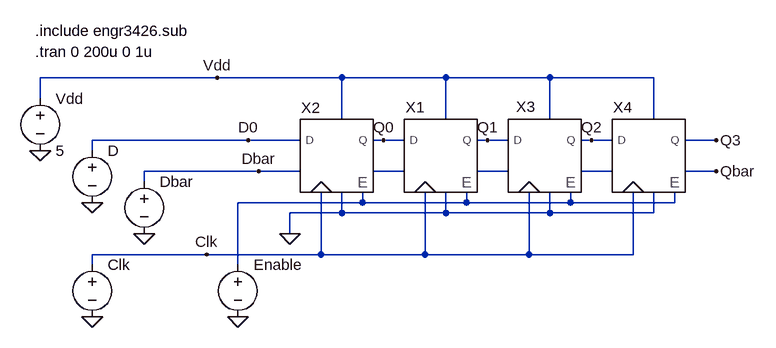
[diagram p0: schematic shiftreg4.asc]
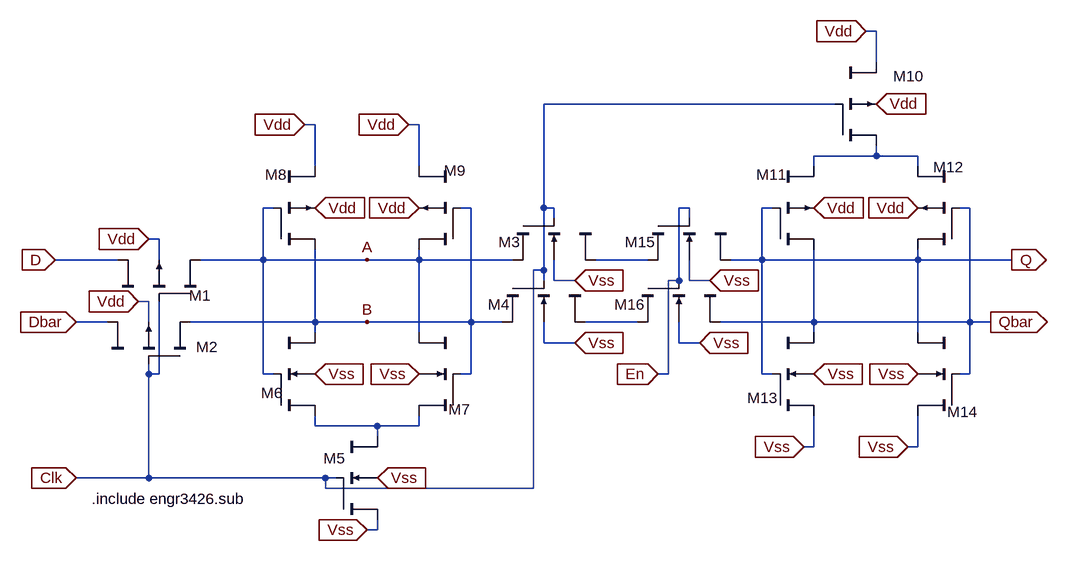
[diagram p1: sub-circuit dflipflop.asc]
shiftreg4.asc, the LTspice schematic file:
Version 4
SHEET 1 928 680
WIRE 80 64 -192 64
WIRE 272 64 80 64
WIRE 432 64 272 64
WIRE 592 64 432 64
WIRE 752 64 592 64
WIRE -192 96 -192 64
WIRE 272 128 272 64
WIRE 432 128 432 64
WIRE 592 128 592 64
WIRE 752 128 752 64
WIRE 128 160 -112 160
WIRE 208 160 128 160
WIRE 336 160 320 160
WIRE 368 160 336 160
WIRE 496 160 480 160
WIRE 528 160 496 160
WIRE 656 160 640 160
WIRE 688 160 656 160
WIRE 848 160 800 160
WIRE -112 176 -112 160
WIRE 144 208 -32 208
WIRE 208 208 144 208
WIRE 368 208 320 208
WIRE 528 208 480 208
WIRE 688 208 640 208
WIRE 848 208 800 208
WIRE -32 224 -32 208
WIRE 304 256 304 240
WIRE 304 256 112 256
WIRE 464 256 464 240
WIRE 464 256 304 256
WIRE 624 256 624 240
WIRE 624 256 464 256
WIRE 784 256 784 240
WIRE 784 256 624 256
WIRE 272 272 272 240
WIRE 272 272 192 272
WIRE 432 272 432 240
WIRE 432 272 272 272
WIRE 592 272 592 240
WIRE 592 272 432 272
WIRE 752 272 752 240
WIRE 752 272 592 272
WIRE 192 304 192 272
WIRE 64 336 -112 336
WIRE 240 336 240 240
WIRE 240 336 64 336
WIRE 400 336 400 240
WIRE 400 336 240 336
WIRE 560 336 560 240
WIRE 560 336 400 336
WIRE 720 336 720 240
WIRE 720 336 560 336
WIRE -112 352 -112 336
WIRE 112 352 112 256
FLAG -192 176 0
FLAG -112 432 0
FLAG -32 304 0
FLAG -112 256 0
FLAG 128 160 D0
FLAG 64 336 Clk
FLAG 848 208 Qbar
FLAG 144 208 Dbar
FLAG 80 64 Vdd
FLAG 192 304 0
FLAG 336 160 Q0
FLAG 496 160 Q1
FLAG 656 160 Q2
FLAG 848 160 Q3
FLAG 112 432 0
SYMBOL voltage -192 80 R0
WINDOW 123 0 0 Left 2
WINDOW 39 0 0 Left 2
SYMATTR InstName Vdd
SYMATTR Value 5
SYMBOL voltage -112 336 R0
WINDOW 3 24 96 Invisible 2
WINDOW 123 0 0 Left 2
WINDOW 39 0 0 Left 2
SYMATTR Value PULSE(0 5 2u 1n 1n 7u 14u 100)
SYMATTR InstName Clk
SYMBOL voltage -32 208 R0
WINDOW 3 24 96 Invisible 2
WINDOW 123 0 0 Left 2
WINDOW 39 0 0 Left 2
SYMATTR Value PULSE(5 0 10u 1n 1n 10u 80u 2)
SYMATTR InstName Dbar
SYMBOL voltage -112 160 R0
WINDOW 3 24 96 Invisible 2
WINDOW 123 0 0 Left 2
WINDOW 39 0 0 Left 2
SYMATTR Value PULSE(0 5 10u 1n 1n 10u 80u 2)
SYMATTR InstName D
SYMBOL dflipflop 272 192 R0
WINDOW 0 -48 -66 Bottom 2
SYMATTR InstName X2
SYMBOL dflipflop 432 192 R0
WINDOW 0 -47 -67 Bottom 2
SYMATTR InstName X1
SYMBOL dflipflop 592 192 R0
WINDOW 0 -37 -68 Bottom 2
SYMATTR InstName X3
SYMBOL dflipflop 752 192 R0
WINDOW 0 -48 -67 Bottom 2
SYMATTR InstName X4
SYMBOL voltage 112 336 R0
WINDOW 3 24 96 Invisible 2
WINDOW 123 0 0 Left 2
WINDOW 39 0 0 Left 2
SYMATTR Value PULSE(5 0 0 1n 1n 100u 200u 1)
SYMATTR InstName Enable
TEXT -200 24 Left 2 !.tran 0 200u 0 1u
TEXT -200 -8 Left 2 !.include engr3426.sub

dflipflop.asc, the sub-circuit schematic file:
Version 4
SHEET 1 1276 680
WIRE 976 -432 960 -432
WIRE 976 -384 976 -432
WIRE 912 -320 464 -320
WIRE 112 -288 96 -288
WIRE 272 -288 256 -288
WIRE 976 -240 976 -256
WIRE 976 -240 880 -240
WIRE 1040 -240 976 -240
WIRE 112 -224 112 -288
WIRE 272 -224 272 -288
WIRE 880 -224 880 -240
WIRE 1040 -224 1040 -240
WIRE 48 -160 32 -160
WIRE 352 -160 336 -160
WIRE 464 -160 464 -320
WIRE 480 -160 464 -160
WIRE 688 -160 672 -160
WIRE 816 -160 800 -160
WIRE 1120 -160 1104 -160
WIRE 480 -144 480 -160
WIRE 688 -144 688 -160
WIRE -128 -112 -144 -112
WIRE -192 -80 -288 -80
WIRE -128 -80 -128 -112
WIRE 32 -80 32 -160
WIRE 32 -80 -64 -80
WIRE 192 -80 32 -80
WIRE 272 -80 272 -96
WIRE 272 -80 192 -80
WIRE 416 -80 272 -80
WIRE 624 -80 544 -80
WIRE 800 -80 800 -160
WIRE 800 -80 752 -80
WIRE 1040 -80 1040 -96
WIRE 1040 -80 800 -80
WIRE 1184 -80 1040 -80
WIRE 464 -64 464 -160
WIRE 464 -64 448 -64
WIRE 464 -48 464 -64
WIRE 480 -48 480 -80
WIRE 512 -48 480 -48
WIRE 672 -48 672 -160
WIRE 672 -48 656 -48
WIRE 688 -48 688 -80
WIRE 720 -48 688 -48
WIRE -144 -16 -160 -16
WIRE -208 16 -256 16
WIRE -144 16 -144 -16
WIRE 112 16 112 -96
WIRE 112 16 -80 16
WIRE 192 16 112 16
WIRE 352 16 352 -160
WIRE 352 16 192 16
WIRE 400 16 352 16
WIRE 608 16 528 16
WIRE 880 16 880 -96
WIRE 880 16 736 16
WIRE 1120 16 1120 -160
WIRE 1120 16 880 16
WIRE 1152 16 1120 16
WIRE 112 32 112 16
WIRE 272 32 272 -80
WIRE 880 32 880 16
WIRE 1040 32 1040 -80
WIRE 464 48 464 16
WIRE 512 48 464 48
WIRE 672 48 672 16
WIRE 704 48 672 48
WIRE -144 96 -144 80
WIRE -128 96 -128 -16
WIRE -128 96 -144 96
WIRE 32 96 32 -80
WIRE 48 96 32 96
WIRE 352 96 352 16
WIRE 352 96 336 96
WIRE 656 96 656 -48
WIRE 656 96 640 96
WIRE 800 96 800 -80
WIRE 816 96 800 96
WIRE 1120 96 1120 16
WIRE 1120 96 1104 96
WIRE 112 176 112 160
WIRE 208 176 112 176
WIRE 272 176 272 160
WIRE 272 176 208 176
WIRE 208 192 208 176
WIRE 880 208 880 160
WIRE 880 208 864 208
WIRE 1040 208 1040 160
WIRE 1040 208 1024 208
WIRE -144 256 -144 96
WIRE -144 256 -256 256
WIRE 128 256 -144 256
WIRE 144 256 128 256
WIRE 128 272 128 256
WIRE 448 272 448 -64
WIRE 448 272 128 272
WIRE 208 336 208 320
WIRE 208 336 192 336
FLAG 256 -288 Vdd
IOPIN 256 -288 In
FLAG 96 -288 Vdd
IOPIN 96 -288 In
FLAG 192 336 Vss
IOPIN 192 336 In
FLAG 272 96 Vss
IOPIN 272 96 In
FLAG 112 96 Vss
IOPIN 112 96 In
FLAG 272 -160 Vdd
IOPIN 272 -160 In
FLAG 112 -160 Vdd
IOPIN 112 -160 In
FLAG 208 256 Vss
IOPIN 208 256 In
FLAG -144 -112 Vdd
IOPIN -144 -112 In
FLAG -160 -16 Vdd
IOPIN -160 -16 In
FLAG 512 -48 Vss
IOPIN 512 -48 In
FLAG 512 48 Vss
IOPIN 512 48 In
FLAG 1040 96 Vss
IOPIN 1040 96 In
FLAG 880 96 Vss
IOPIN 880 96 In
FLAG 1040 -160 Vdd
IOPIN 1040 -160 In
FLAG 880 -160 Vdd
IOPIN 880 -160 In
FLAG 976 -320 Vdd
IOPIN 976 -320 In
FLAG 960 -432 Vdd
IOPIN 960 -432 In
FLAG -288 -80 D
IOPIN -288 -80 In
FLAG -256 16 Dbar
IOPIN -256 16 In
FLAG 1184 -80 Q
IOPIN 1184 -80 Out
FLAG 1152 16 Qbar
IOPIN 1152 16 Out
FLAG -256 256 Clk
IOPIN -256 256 In
FLAG 864 208 Vss
IOPIN 864 208 In
FLAG 1024 208 Vss
IOPIN 1024 208 In
FLAG 192 -80 A
FLAG 192 16 B
FLAG 720 -48 Vss
IOPIN 720 -48 In
FLAG 704 48 Vss
IOPIN 704 48 In
FLAG 640 96 En
IOPIN 640 96 In
SYMBOL cktsym\\pmos4 -144 16 R270
WINDOW 0 -38 73 VRight 2
WINDOW 3 16 16 Invisible 2
SYMATTR InstName M2
SYMATTR Value2 l=.6u w=1.2u
SYMBOL cktsym\\pmos4 -128 -80 R270
WINDOW 0 -55 46 VRight 2
WINDOW 3 16 16 Invisible 2
SYMATTR InstName M1
SYMATTR Value2 l=.6u w=1.2u
SYMBOL cktsym\\nmos4 464 16 R90
WINDOW 0 -27 52 VRight 2
WINDOW 3 16 16 Invisible 2
SYMATTR InstName M4
SYMATTR Value2 l=2.4u w=1.2u
SYMBOL cktsym\\nmos4 208 256 R0
WINDOW 0 -83 -30 Left 2
WINDOW 3 16 16 Invisible 2
SYMATTR InstName M5
SYMATTR Value2 l=.6u w=1.2u
SYMBOL cktsym\\nmos4 112 96 R0
WINDOW 0 -83 29 Left 2
WINDOW 3 16 16 Invisible 2
SYMATTR InstName M6
SYMATTR Value2 l=.6u w=1.2u
SYMBOL cktsym\\nmos4 272 96 M0
WINDOW 0 -79 54 Left 2
WINDOW 3 16 16 Invisible 2
SYMATTR InstName M7
SYMATTR Value2 l=.6u w=1.2u
SYMBOL cktsym\\pmos4 112 -160 R0
WINDOW 0 -77 -51 Left 2
WINDOW 3 16 16 Invisible 2
SYMATTR InstName M8
SYMATTR Value2 l=.6u w=1.2u
SYMBOL cktsym\\pmos4 272 -160 M0
WINDOW 0 -72 -57 Left 2
WINDOW 3 16 16 Invisible 2
SYMATTR InstName M9
SYMATTR Value2 l=.6u w=1.2u
SYMBOL cktsym\\pmos4 976 -320 R0
WINDOW 0 26 -43 Left 2
WINDOW 3 16 16 Invisible 2
SYMATTR InstName M10
SYMATTR Value2 l=.6u w=1.2u
SYMBOL cktsym\\nmos4 880 96 R0
WINDOW 0 -103 37 Left 2
WINDOW 3 16 16 Invisible 2
SYMATTR InstName M13
SYMATTR Value2 l=.6u w=1.2u
SYMBOL cktsym\\nmos4 1040 96 M0
WINDOW 0 -92 58 Left 2
WINDOW 3 16 16 Invisible 2
SYMATTR InstName M14
SYMATTR Value2 l=.6u w=1.2u
SYMBOL cktsym\\pmos4 880 -160 R0
WINDOW 0 -89 -51 Left 2
WINDOW 3 16 16 Invisible 2
SYMATTR InstName M11
SYMATTR Value2 l=.6u w=1.2u
SYMBOL cktsym\\pmos4 1040 -160 M0
WINDOW 0 -71 -63 Left 2
WINDOW 3 16 16 Invisible 2
SYMATTR InstName M12
SYMATTR Value2 l=.6u w=1.2u
SYMBOL cktsym\\nmos4 480 -80 R90
WINDOW 0 -27 52 VRight 2
WINDOW 3 16 16 Invisible 2
SYMATTR InstName M3
SYMATTR Value2 l=2.4u w=1.2u
SYMBOL cktsym\\nmos4 688 -80 R90
WINDOW 0 -27 52 VRight 2
WINDOW 3 16 16 Invisible 2
SYMATTR InstName M15
SYMATTR Value2 l=2.4u w=1.2u
SYMBOL cktsym\\nmos4 672 16 R90
WINDOW 0 -27 52 VRight 2
WINDOW 3 16 16 Invisible 2
SYMATTR InstName M16
SYMATTR Value2 l=2.4u w=1.2u
TEXT -232 288 Left 2 !.include engr3426.sub

The netlist it stands for:
* shiftreg4.asc
Vdd Vdd 0 5
V§Clk Clk 0 PULSE(0 5 2u 1n 1n 7u 14u 100)
V§Dbar Dbar 0 PULSE(5 0 10u 1n 1n 10u 80u 2)
V§D D0 0 PULSE(0 5 10u 1n 1n 10u 80u 2)
XX2 Clk D0 Dbar Vdd 0 Q0 N001 N004 dflipflop
XX1 Clk Q0 N001 Vdd 0 Q1 N002 N004 dflipflop
XX3 Clk Q1 N002 Vdd 0 Q2 N003 N004 dflipflop
XX4 Clk Q2 N003 Vdd 0 Q3 Qbar N004 dflipflop
V§Enable N004 0 PULSE(5 0 0 1n 1n 100u 200u 1)

* block symbol definitions
.subckt dflipflop Clk D Dbar Vdd Vss Q Qbar En
M2 B Clk Dbar Vdd PMOS l=.6u w=1.2u
M1 A Clk D Vdd PMOS l=.6u w=1.2u
M4 N003 Clk B Vss NMOS l=2.4u w=1.2u
M5 N004 Clk Vss Vss NMOS l=.6u w=1.2u
M6 B A N004 Vss NMOS l=.6u w=1.2u
M7 A B N004 Vss NMOS l=.6u w=1.2u
M8 B A Vdd Vdd PMOS l=.6u w=1.2u
M9 A B Vdd Vdd PMOS l=.6u w=1.2u
M10 N001 Clk Vdd Vdd PMOS l=.6u w=1.2u
M13 Qbar Q Vss Vss NMOS l=.6u w=1.2u
M14 Q Qbar Vss Vss NMOS l=.6u w=1.2u
M11 Qbar Q N001 Vdd PMOS l=.6u w=1.2u
M12 Q Qbar N001 Vdd PMOS l=.6u w=1.2u
M3 N002 Clk A Vss NMOS l=2.4u w=1.2u
M15 Q En N002 Vss NMOS l=2.4u w=1.2u
M16 Qbar En N003 Vss NMOS l=2.4u w=1.2u
.include engr3426.sub
.ends dflipflop

.model NMOS NMOS
.model PMOS PMOS
.lib standard.mos
.tran 0 200u 0 1u
.include engr3426.sub
.backanno
.end